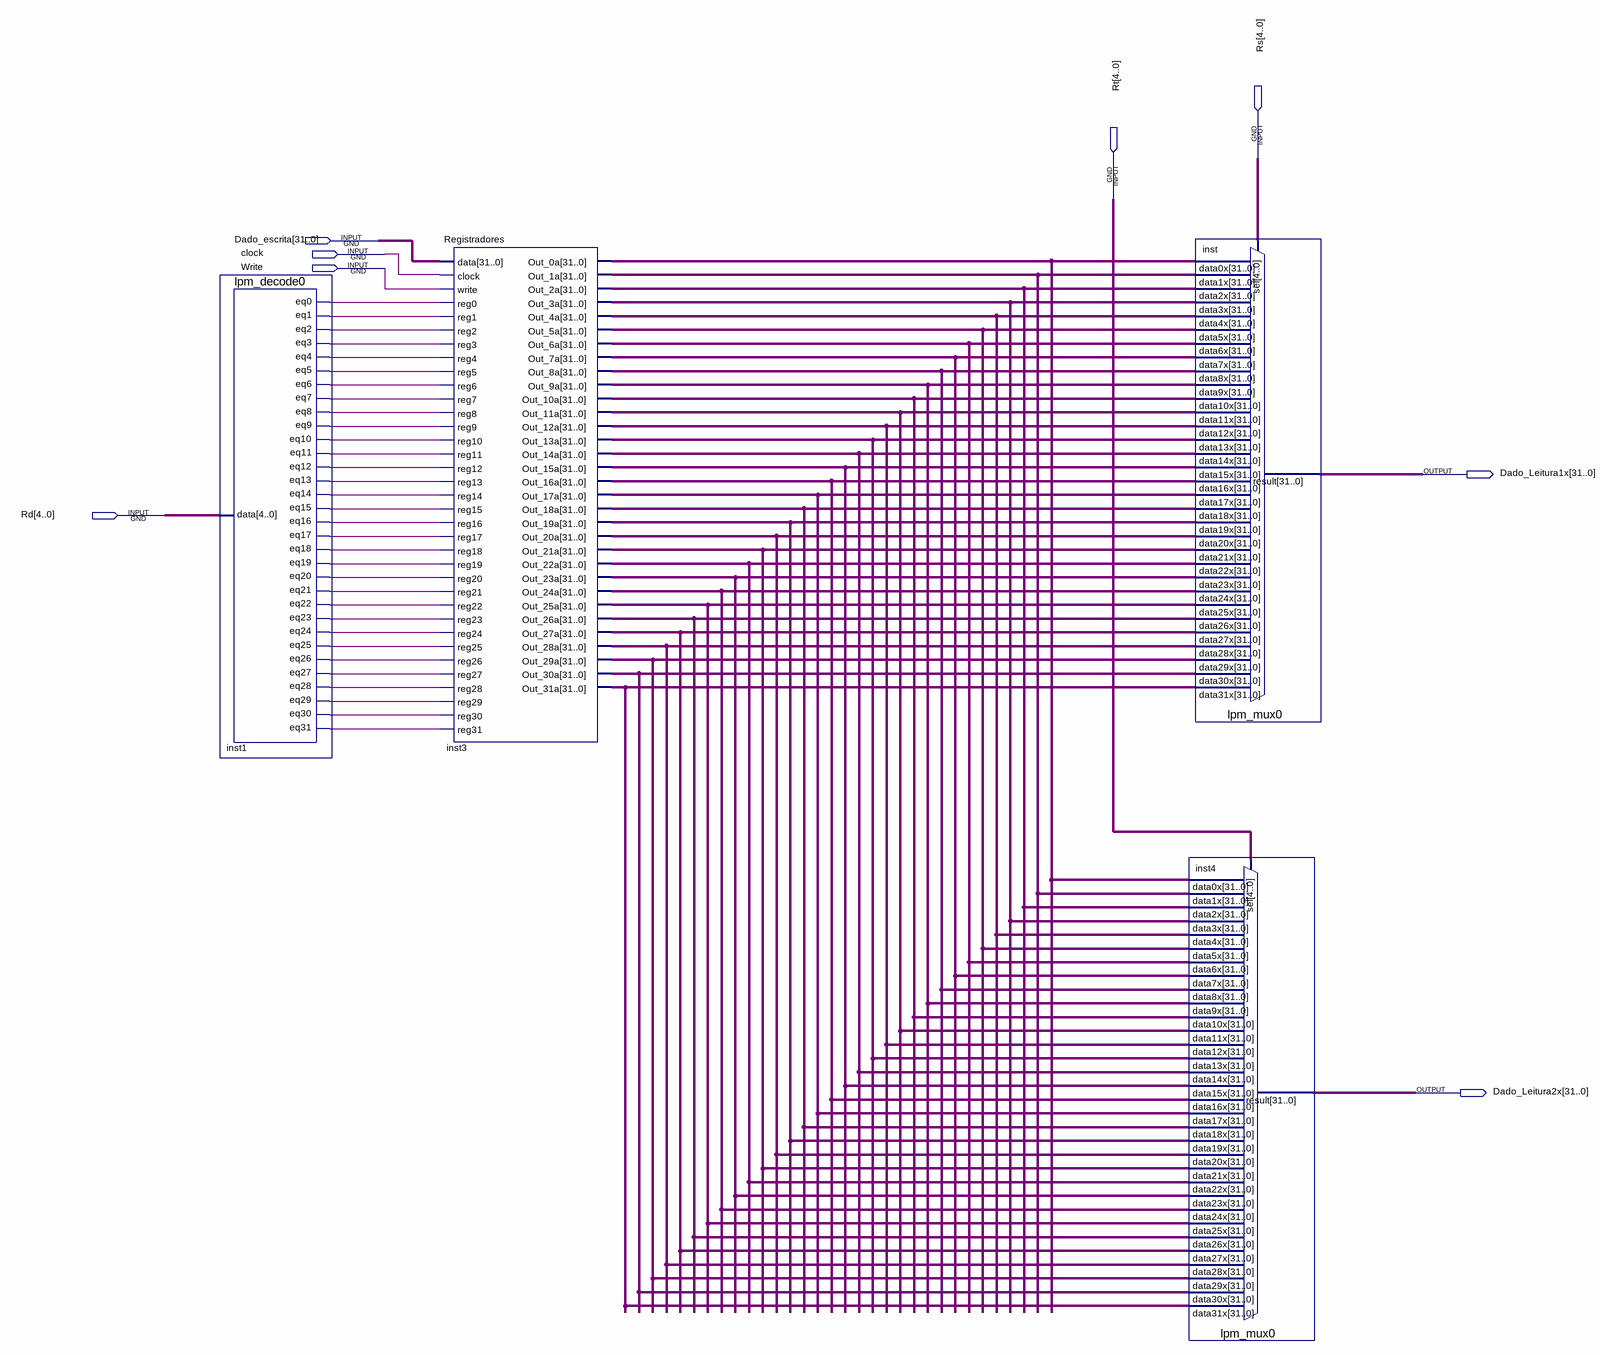
[diagram p0: schematic sheet]
// Quartus schematic Banco_Reg.bdf as structural Verilog: 4 symbols, 8 pins
module Banco_Reg (
  input  [4:0] Rs,
  input  [4:0] Rt,
  input  [31:0] Dado_escrita,
  input  clock,
  input  Write,
  input  [4:0] Rd,
  output [31:0] Dado_Leitura1x,
  output [31:0] Dado_Leitura2x
);

  wire inst1_eq0, inst1_eq1, inst1_eq2, inst1_eq3, inst1_eq4, inst1_eq5, inst1_eq6, inst1_eq7, inst1_eq8,
       inst1_eq9, inst1_eq10, inst1_eq11, inst1_eq12, inst1_eq13, inst1_eq14, inst1_eq15, inst1_eq16,
       inst1_eq17, inst1_eq18, inst1_eq19, inst1_eq20, inst1_eq21, inst1_eq22, inst1_eq23, inst1_eq24,
       inst1_eq25, inst1_eq26, inst1_eq27, inst1_eq28, inst1_eq29, inst1_eq30, inst1_eq31;
  wire [31:0] inst3_out_0a, inst3_out_1a, inst3_out_2a, inst3_out_3a, inst3_out_4a, inst3_out_5a,
       inst3_out_6a, inst3_out_7a, inst3_out_8a, inst3_out_9a, inst3_out_10a, inst3_out_11a, inst3_out_12a,
       inst3_out_13a, inst3_out_14a, inst3_out_15a, inst3_out_16a, inst3_out_17a, inst3_out_18a,
       inst3_out_19a, inst3_out_20a, inst3_out_21a, inst3_out_22a, inst3_out_23a, inst3_out_24a,
       inst3_out_25a, inst3_out_26a, inst3_out_27a, inst3_out_28a, inst3_out_29a, inst3_out_30a,
       inst3_out_31a;

  lpm_decode0 inst1 (
    .data(Rd), .eq0(inst1_eq0), .eq1(inst1_eq1), .eq2(inst1_eq2), .eq3(inst1_eq3), .eq4(inst1_eq4),
    .eq5(inst1_eq5), .eq6(inst1_eq6), .eq7(inst1_eq7), .eq8(inst1_eq8), .eq9(inst1_eq9), .eq10(inst1_eq10),
    .eq11(inst1_eq11), .eq12(inst1_eq12), .eq13(inst1_eq13), .eq14(inst1_eq14), .eq15(inst1_eq15),
    .eq16(inst1_eq16), .eq17(inst1_eq17), .eq18(inst1_eq18), .eq19(inst1_eq19), .eq20(inst1_eq20),
    .eq21(inst1_eq21), .eq22(inst1_eq22), .eq23(inst1_eq23), .eq24(inst1_eq24), .eq25(inst1_eq25),
    .eq26(inst1_eq26), .eq27(inst1_eq27), .eq28(inst1_eq28), .eq29(inst1_eq29), .eq30(inst1_eq30),
    .eq31(inst1_eq31));
  Registradores inst3 (
    .data(Dado_escrita), .clock(clock), .write(Write), .reg0(inst1_eq0), .reg1(inst1_eq1), .reg2(inst1_eq2),
    .reg3(inst1_eq3), .reg4(inst1_eq4), .reg5(inst1_eq5), .reg6(inst1_eq6), .reg7(inst1_eq7),
    .reg8(inst1_eq8), .reg9(inst1_eq9), .reg10(inst1_eq10), .reg11(inst1_eq11), .reg12(inst1_eq12),
    .reg13(inst1_eq13), .reg14(inst1_eq14), .reg15(inst1_eq15), .reg16(inst1_eq16), .reg17(inst1_eq17),
    .reg18(inst1_eq18), .reg19(inst1_eq19), .reg20(inst1_eq20), .reg21(inst1_eq21), .reg22(inst1_eq22),
    .reg23(inst1_eq23), .reg24(inst1_eq24), .reg25(inst1_eq25), .reg26(inst1_eq26), .reg27(inst1_eq27),
    .reg28(inst1_eq28), .reg29(inst1_eq29), .reg30(inst1_eq30), .reg31(inst1_eq31), .Out_0a(inst3_out_0a),
    .Out_1a(inst3_out_1a), .Out_2a(inst3_out_2a), .Out_3a(inst3_out_3a), .Out_4a(inst3_out_4a),
    .Out_5a(inst3_out_5a), .Out_6a(inst3_out_6a), .Out_7a(inst3_out_7a), .Out_8a(inst3_out_8a),
    .Out_9a(inst3_out_9a), .Out_10a(inst3_out_10a), .Out_11a(inst3_out_11a), .Out_12a(inst3_out_12a),
    .Out_13a(inst3_out_13a), .Out_14a(inst3_out_14a), .Out_15a(inst3_out_15a), .Out_16a(inst3_out_16a),
    .Out_17a(inst3_out_17a), .Out_18a(inst3_out_18a), .Out_19a(inst3_out_19a), .Out_20a(inst3_out_20a),
    .Out_21a(inst3_out_21a), .Out_22a(inst3_out_22a), .Out_23a(inst3_out_23a), .Out_24a(inst3_out_24a),
    .Out_25a(inst3_out_25a), .Out_26a(inst3_out_26a), .Out_27a(inst3_out_27a), .Out_28a(inst3_out_28a),
    .Out_29a(inst3_out_29a), .Out_30a(inst3_out_30a), .Out_31a(inst3_out_31a));
  lpm_mux0 inst (
    .data31x(inst3_out_31a), .data30x(inst3_out_30a), .data29x(inst3_out_29a), .data28x(inst3_out_28a),
    .data27x(inst3_out_27a), .data26x(inst3_out_26a), .data25x(inst3_out_25a), .data24x(inst3_out_24a),
    .data23x(inst3_out_23a), .data22x(inst3_out_22a), .data21x(inst3_out_21a), .data20x(inst3_out_20a),
    .data19x(inst3_out_19a), .data18x(inst3_out_18a), .data17x(inst3_out_17a), .data16x(inst3_out_16a),
    .data15x(inst3_out_15a), .data14x(inst3_out_14a), .data13x(inst3_out_13a), .data12x(inst3_out_12a),
    .data11x(inst3_out_11a), .data10x(inst3_out_10a), .data9x(inst3_out_9a), .data8x(inst3_out_8a),
    .data7x(inst3_out_7a), .data6x(inst3_out_6a), .data5x(inst3_out_5a), .data4x(inst3_out_4a),
    .data3x(inst3_out_3a), .data2x(inst3_out_2a), .data1x(inst3_out_1a), .data0x(inst3_out_0a), .sel(Rs),
    .result(Dado_Leitura1x));
  lpm_mux0 inst4 (
    .data31x(inst3_out_31a), .data30x(inst3_out_30a), .data29x(inst3_out_29a), .data28x(inst3_out_28a),
    .data27x(inst3_out_27a), .data26x(inst3_out_26a), .data25x(inst3_out_25a), .data24x(inst3_out_24a),
    .data23x(inst3_out_23a), .data22x(inst3_out_22a), .data21x(inst3_out_21a), .data20x(inst3_out_20a),
    .data19x(inst3_out_19a), .data18x(inst3_out_18a), .data17x(inst3_out_17a), .data16x(inst3_out_16a),
    .data15x(inst3_out_15a), .data14x(inst3_out_14a), .data13x(inst3_out_13a), .data12x(inst3_out_12a),
    .data11x(inst3_out_11a), .data10x(inst3_out_10a), .data9x(inst3_out_9a), .data8x(inst3_out_8a),
    .data7x(inst3_out_7a), .data6x(inst3_out_6a), .data5x(inst3_out_5a), .data4x(inst3_out_4a),
    .data3x(inst3_out_3a), .data2x(inst3_out_2a), .data1x(inst3_out_1a), .data0x(inst3_out_0a), .sel(Rt),
    .result(Dado_Leitura2x));
endmodule
